# EAGLE design pol (EAGLE 6.5.0)
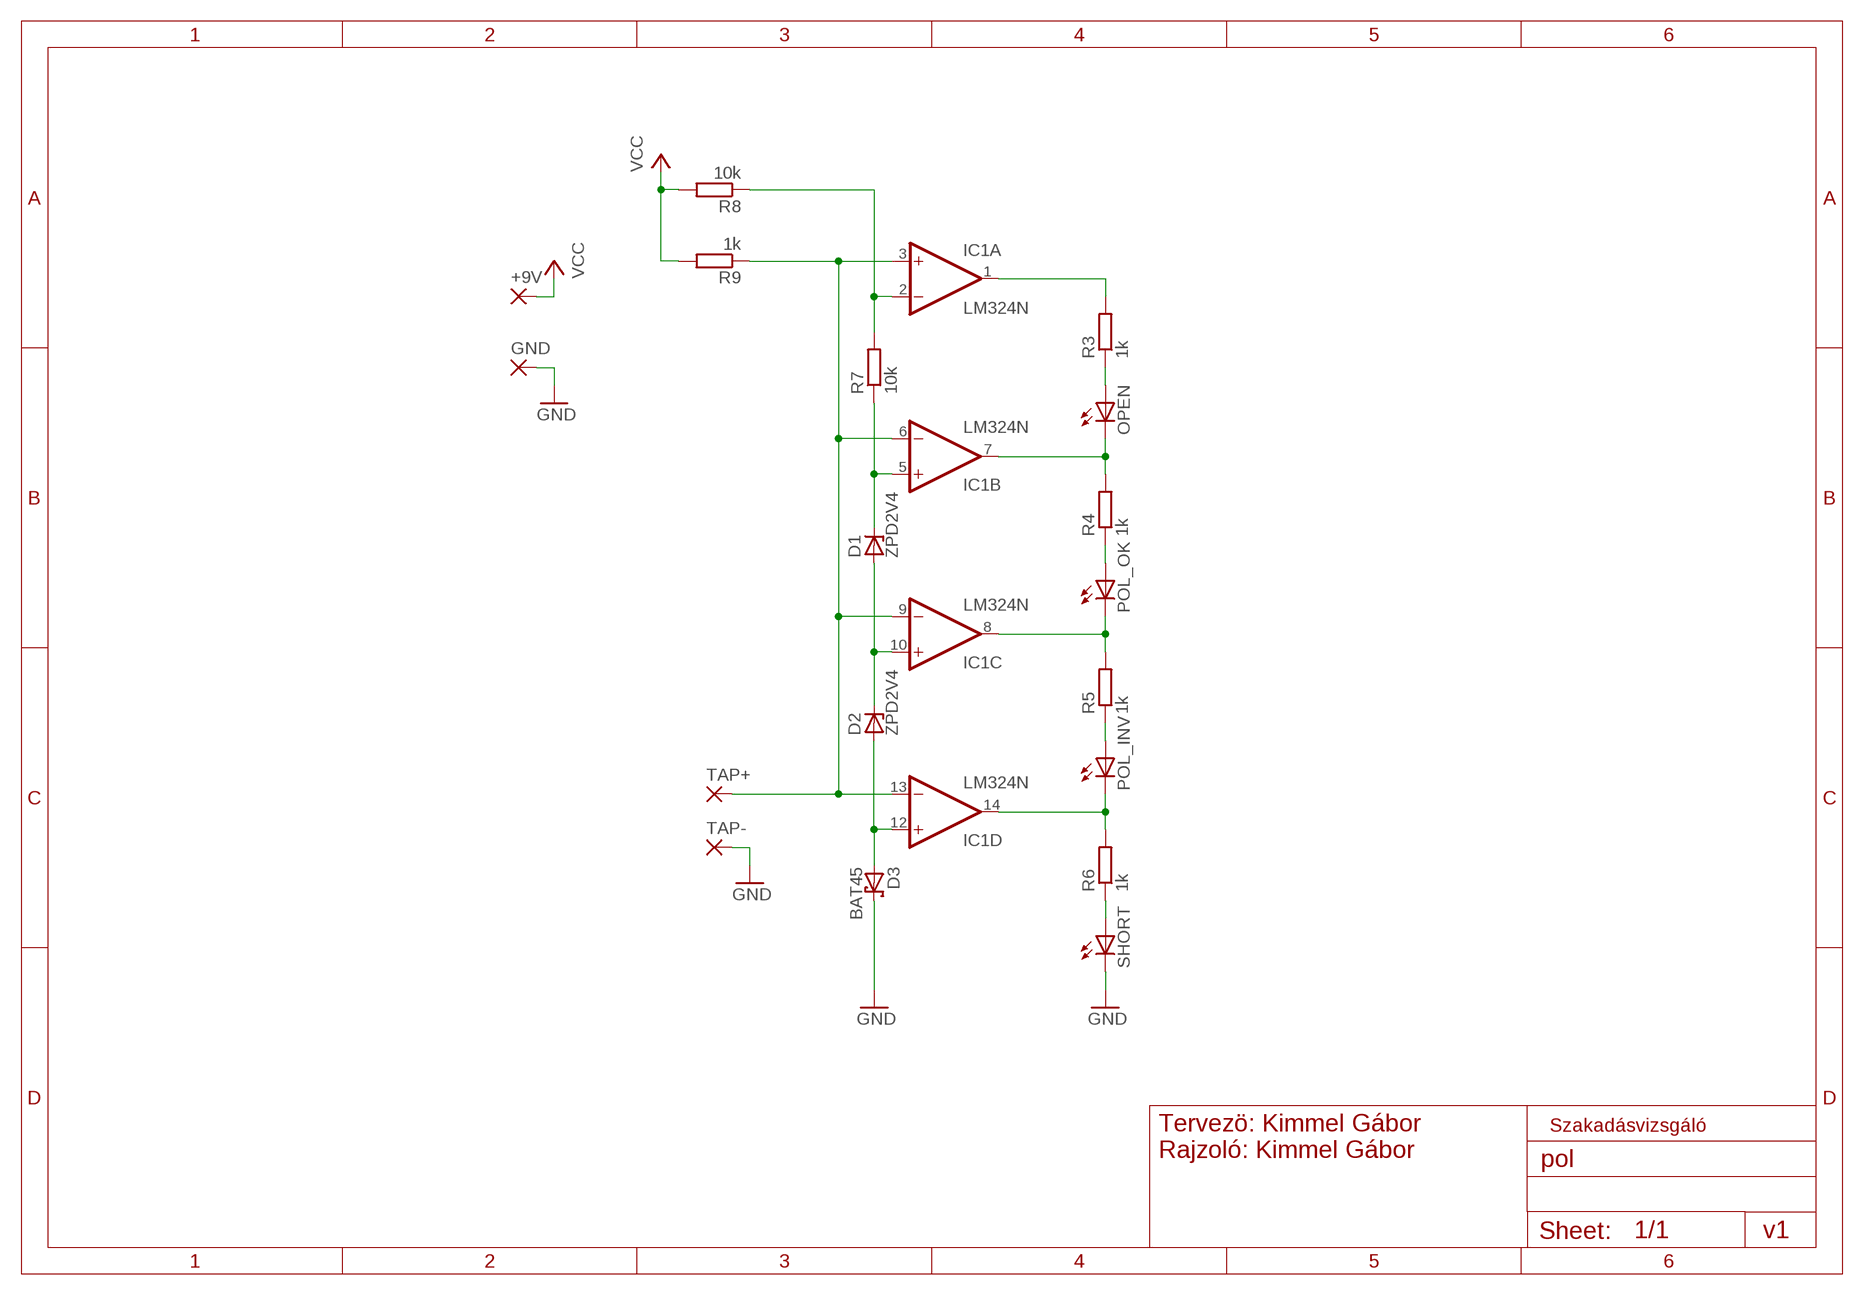
[diagram p0: schematic, sheet 1]

## Parts
+9V  2,54/1,0  [2,54/1,0]
D1  ZPD2V4  ZPD  [DO35Z10]
D2  ZPD2V4  ZPD  [DO35Z10]
D3  BAT45  BAT42  [DO35-10]
GND  2,54/1,0  [2,54/1,0]
IC1  LM324N  [DIL14]
OPEN  LED5MM  [LED5MM]
POL_INV  LED5MM  [LED5MM]
POL_OK  LED5MM  [LED5MM]
R3  1k  R-EU_0309/12  [0309/12]
R4  1k  R-EU_0309/12  [0309/12]
R5  1k  R-EU_0309/12  [0309/12]
R6  1k  R-EU_0309/12  [0309/12]
R7  10k  R-EU_0309/12  [0309/12]
R8  10k  R-EU_0309/12  [0309/12]
R9  1k  R-EU_0309/12  [0309/12]
SHORT  LED5MM  [LED5MM]
TAP+  2,54/1,0  [2,54/1,0]
TAP-  2,54/1,0  [2,54/1,0]

## Nets
GND: D3.C GND.1(P) SHORT.K(C) TAP-.1(P)
N$4: IC1.14(D:OUT) POL_INV.K(C) R6.2
N$5: R6.1 SHORT.A
N$6: POL_INV.A R5.1
N$7: IC1.8(C:OUT) POL_OK.K(C) R5.2
N$8: POL_OK.A R4.1
N$9: IC1.7(B:OUT) OPEN.K(C) R4.2
N$10: OPEN.A R3.1
N$11: IC1.1(A:OUT) R3.2
N$12: D2.A D3.A IC1.12(D:+IN)
N$13: D1.A D2.C IC1.10(C:+IN)
N$14: D1.C IC1.5(B:+IN) R7.1
N$15: IC1.2(A:-IN) R7.2 R8.1
N$16: IC1.3(A:+IN) IC1.6(B:-IN) IC1.9(C:-IN) IC1.13(D:-IN) R9.1 TAP+.1(P)
VCC: +9V.1(P) R8.2 R9.2

## Notes on the sheet
- Tervezö: Kimmel Gábor
  Rajzoló: Kimmel Gábor
- Szakadásvizsgáló
- v1

## Power pins joined to a net without a drawn wire
V+: IC1.4(P:V+)
V-: IC1.11(P:V-)

## Library data of the parts
+9V GND TAP+ TAP- = wirepad:2,54/1,0: THROUGH-HOLE PAD
D1 D2 = diode:ZPD: Z DIODE 500 mW
D3 = diode:BAT42: DIODE barrier diode
IC1 = linear:LM324: OP AMP
OPEN POL_INV POL_OK SHORT = led:LED: LED OSRAM: - CHIPLED LG R971, LG N971, LY N971, LG Q971, LY Q971, LO R971, LY R971 LH N974, LH R974 LS Q976, LO Q976, LY Q976 LO Q996 - Hyper CHIPLED LW Q18S LB Q993, LB Q99A, LB R99A - SideLED LS A670, LO A670, LY A670, LG A670, LP A670 LB A673, LV A673, LT A673, LW A673 LH A674 LY A675 LS A676, LA A676, LO A676, LY A676, LW A676 LS A679, LY A679, LG A679 - Hyper Micro SIDELED® LS Y876, LA Y876, LO Y876, LY Y876 LT Y87S - SmartLED LW L88C, LW L88S LB L89C, LB L89S, LG L890 LS L89K, LO L89K, LY L89K LS L896, LA L896, LO L896, LY L896 - TOPLED LS T670, LO T670, LY T670, LG T670, LP T670 LSG T670, LSP T670, LSY T670, LOP T670, LYG T670 LG T671, LOG T671, LSG T671 LB T673, LV T673, LT T673, LW T673 LH T674 LS T676, LA T676, LO T676, LY T676, LB T676, LH T676, LSB T676, LW T676 LB T67C, LV T67C, LT T67C, LS T67K, LO T67K, LY T67K, LW E67C LS E67B, LA E67B, LO E67B, LY E67B, LB E67C, LV E67C, LT E67C LW T67C LS T679, LY T679, LG T679 LS T770, LO T770, LY T770, LG T770, LP T770 LB T773, LV T773, LT T773, LW T773 LH T774 LS E675, LA E675, LY E675, LS T675 LS T776, LA T776, LO T776, LY T776, LB T776 LHGB T686 LT T68C, LB T68C - Hyper Mini TOPLED® LB M676 - Mini TOPLED Santana® LG M470 LS M47K, LO M47K, LY M47K Source: http://www.osram.convergy.de LUXEON: - LUMILED® LXK2-PW12-R00, LXK2-PW12-S00, LXK2-PW14-U00, LXK2-PW14-V00 LXK2-PM12-R00, LXK2-PM12-S00, LXK2-PM14-U00 LXK2-PE12-Q00, LXK2-PE12-R00, LXK2-PE12-S00, LXK2-PE14-T00, LXK2-PE14-U00 LXK2-PB12-K00, LXK2-PB12-L00, LXK2-PB12-M00, LXK2-PB14-N00, LXK2-PB14-P00, LXK2-PB14-Q00 LXK2-PR12-L00, LXK2-PR12-M00, LXK2-PR14-Q00, LXK2-PR14-R00 LXK2-PD12-Q00, LXK2-PD12-R00, LXK2-PD12-S00 LXK2-PH12-R00, LXK2-PH12-S00 LXK2-PL12-P00, LXK2-PL12-Q00, LXK2-PL12-R00 Source: www.luxeon.com KINGBRIGHT: KA-3528ASYC Source: www.kingbright.com
R3-R9 = resistor:R-EU_: RESISTOR, European symbol

## Board
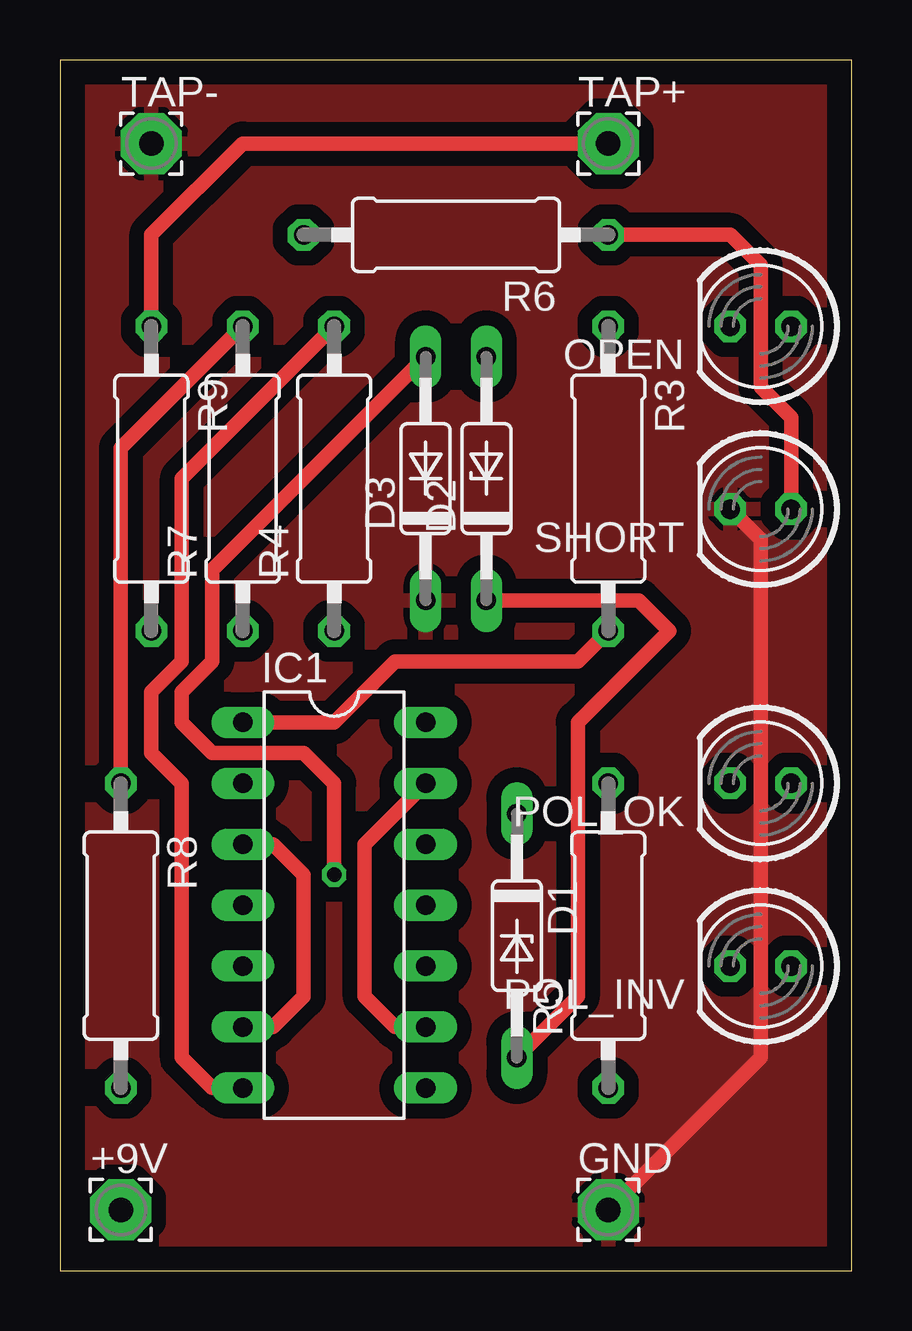
[diagram p1: board, top side]
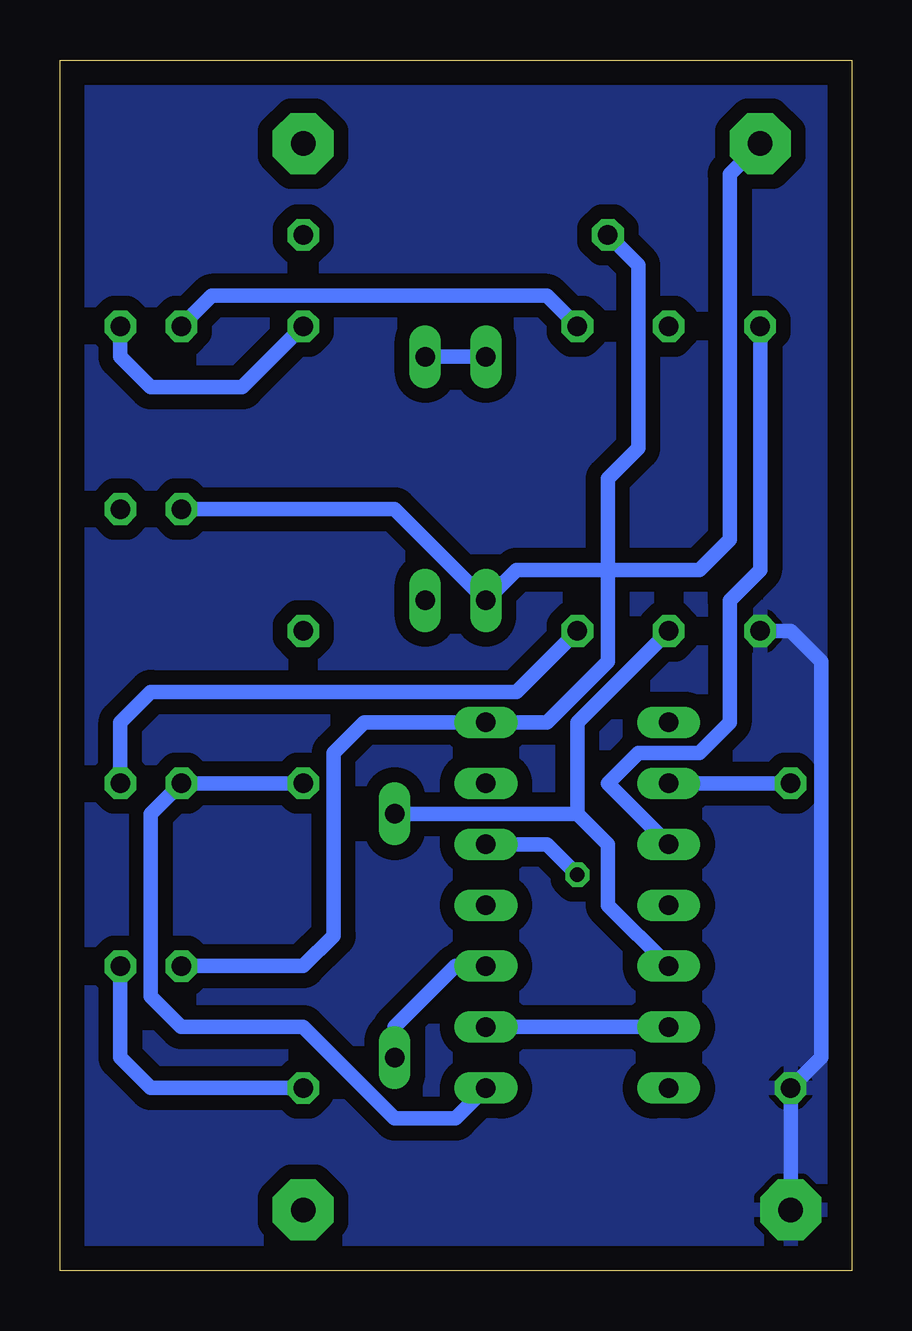
[diagram p2: board, bottom side, seen from below]

Size 33 x 50.47 mm. Coordinates in mm from the lower left corner, seen from the top.
Outline: 0,0 33,0 33,50.47 0,50.47 0,0
Copper layers (1*16): Top 0.035mm / dielectric 1.5mm / Bottom 0.035mm
Design rules "default": minimum track width 10mil, minimum drill 24mil, track to track 8mil, track to pad 8mil, pad to pad 8mil, via to via 8mil, smd to smd 8mil, copper to edge 40mil, drill to drill 8mil, minimum pad ring 10mil, minimum via ring 8mil, stop-mask expansion 4mil, vias tented up to drill 0mil, thermal gap 10mil

### Footprints (pad centres in the part's own frame; a part is rotated, then mirrored left to right if it is on the bottom)
2,54/1,0 = drill 1.016 pad 2.54 octagon: 1 0,0
DO35Z10 = drill 0.813 long: A 5.08,0; C -5.08,0
DO35-10 = drill 0.813 long: A 5.08,0; C -5.08,0
DIL14 = drill 0.813 long: 1 -7.62,-3.81; 2 -5.08,-3.81; 3 -2.54,-3.81; 4 0,-3.81; 5 2.54,-3.81; 6 5.08,-3.81; 7 7.62,-3.81; 8 7.62,3.81; 9 5.08,3.81; 10 2.54,3.81; 11 0,3.81; 12 -2.54,3.81; 13 -5.08,3.81; 14 -7.62,3.81
LED5MM = drill 0.813 octagon: A -1.27,0; K 1.27,0
0309/12 = drill 0.813 octagon: 1 -6.35,0; 2 6.35,0

### Placement (x,y rotation side)
+9V  2.54,2.54 0 top
D1  19.05,13.97 270 top
D2  17.78,33.02 90 top
D3  15.24,33.02 90 top
GND  22.86,2.54 0 top
IC1  11.43,15.24 270 top
OPEN  29.21,39.37 180 top
POL_INV  29.21,12.7 180 top
POL_OK  29.21,20.32 180 top
R3  22.86,33.02 270 top
R4  11.43,33.02 90 top
R5  22.86,13.97 90 top
R6  16.51,43.18 180 top
R7  7.62,33.02 90 top
R8  2.54,13.97 270 top
R9  3.81,33.02 270 top
SHORT  29.21,31.75 180 top
TAP+  22.86,46.99 0 top
TAP-  3.81,46.99 0 top

### Tracks (layer width: path | path; a pad name or v marks a point on that pad's centre or on a via)
GND
  Top 0.61: GND.1 29.21,8.89 29.21,30.48 SHORT.K
  Bottom 0.61: TAP-.1 5.08,45.72 5.08,30.48 6.35,29.21 13.97,29.21 D3.C 19.05,31.75 SHORT.K
  pour Top (isolate 0.61): 0,50.8 33.02,50.8 33.02,0 0,0
N$4
  Bottom 0.61: POL_INV.K 22.86,12.7 21.59,13.97 21.59,21.59 20.32,22.86 IC1.14 12.7,22.86 10.16,25.4 10.16,33.02 8.89,34.29 8.89,41.91 R6.2
N$5
  Top 0.61: SHORT.A 30.48,35.56 29.21,36.83 29.21,41.91 27.94,43.18 R6.1
N$6
  Bottom 0.61: POL_INV.A 30.48,8.89 29.21,7.62 R5.1
N$7
  Bottom 0.61: R5.2 POL_OK.K 29.21,19.05 29.21,11.43 27.94,10.16 22.86,10.16 19.05,6.35 16.51,6.35 IC1.8
N$8
  Bottom 0.61: POL_OK.A 30.48,22.86 29.21,24.13 13.97,24.13 R4.1
N$9
  Top 0.61: IC1.7 6.35,7.62 5.08,8.89 5.08,20.32 3.81,21.59 3.81,24.13 5.08,25.4 5.08,33.02 R4.2
  Bottom 0.61: R4.2 12.7,40.64 26.67,40.64 OPEN.K
N$10
  Bottom 0.61: OPEN.A 30.48,38.1 29.21,36.83 25.4,36.83 R3.1
N$11
  Top 0.61: IC1.1 11.43,22.86 13.97,25.4 21.59,25.4 R3.2
N$12  (via drill 0.6)
  Top 0.61: v11.43,16.51 11.43,20.32 10.16,21.59 6.35,21.59 5.08,22.86 5.08,24.13 6.35,25.4 6.35,29.21 D3.A
  Bottom 0.61: D3.A D2.A | IC1.12 12.7,17.78 v11.43,16.51
N$13
  Top 0.61: D2.C 24.13,27.94 25.4,26.67 21.59,22.86 21.59,11.43 D1.A
  Bottom 0.61: D1.A 19.05,10.16 16.51,12.7 IC1.10
N$14
  Bottom 0.61: D1.C 11.43,19.05 | R7.1 11.43,22.86 11.43,19.05 | IC1.5 10.16,15.24 10.16,17.78 11.43,19.05
N$15
  Top 0.61: R7.2 2.54,34.29 R8.1
  Bottom 0.61: IC1.2 R8.1
N$16
  Top 0.61: IC1.3 8.89,17.78 10.16,16.51 10.16,11.43 8.89,10.16 IC1.6 | IC1.13 12.7,17.78 12.7,11.43 13.97,10.16 IC1.9 | R9.1 3.81,43.18 7.62,46.99 TAP+.1
  Bottom 0.61: IC1.9 IC1.6 | R9.1 3.81,29.21 5.08,27.94 5.08,22.86 6.35,21.59 8.89,21.59 10.16,20.32 IC1.3
VCC
  Bottom 0.61: +9V.1 R8.2 1.27,8.89 1.27,25.4 2.54,26.67 R9.2
  pour Bottom (isolate 0.61): 0,0 33.02,0 33.02,50.8 0,50.8